# Altium schematic sheet etapa3_energia.SchDoc
size A4
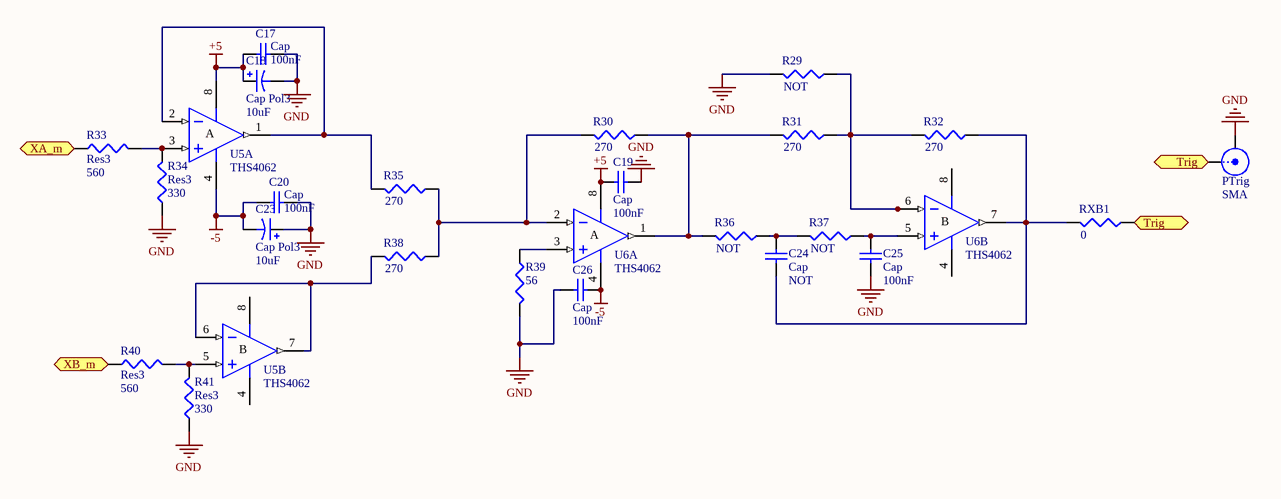
[diagram p0: etapa3_energia.SchDoc]

## Parts
C17  Cap  value 100nF  [6-0805_N]
C18  Cap Pol3  value 10uF  [6-0805_N]
C19  Cap  value 100nF  [1608[0603]]
C20  Cap  value 100nF  [6-0805_N]
C23  Cap Pol3  value 10uF  [6-0805_N]
C24  Cap  value NOT  [1608[0603]]
C25  Cap  value 100nF  [1608[0603]]
C26  Cap  value 100nF  [1608[0603]]
PTrig  SMA  [SMB_V-RJ45]
R29  value NOT  [J1-0603]  (hidden comment: Res3)
R30  value 270  [J1-0603]  (hidden comment: Res3)
R31  value 270  [J1-0603]  (hidden comment: Res3)
R32  value 270  [J1-0603]  (hidden comment: Res3)
R33  Res3  value 560  [J1-0603]
R34  Res3  value 330  [J1-0603]
R35  value 270  [J1-0603]  (hidden comment: Res3)
R36  value NOT  [J1-0603]  (hidden comment: Res3)
R37  value NOT  [J1-0603]  (hidden comment: Res3)
R38  value 270  [J1-0603]  (hidden comment: Res3)
R39  value 56  [J1-0603]  (hidden comment: Res3)
R40  Res3  value 560  [J1-0603]
R41  Res3  value 330  [J1-0603]
RXB1  value 0  [J1-0603]  (hidden comment: Res3)
U5  THS4062  [SO-8_M]  (parts A,B of 2)
U6  THS4062  [SO-8_M]  (parts A,B of 2)

## Ports
Trig (out), XA_m (out), XB_m (out)

## Nets
+5: C17.2 C18.1 C19.1 U5.8(V+) U6.8(V+)
-5: C20.2 C23.2 C26.2 U5.4(V-) U6.4(V-)
GND: C17.1 C18.2 C19.2 C20.1 C23.1 C25.2 C26.1 PTrig.2(Y) R29.2 R34.1 R39.2 R41.1
Trig: PTrig.1(X) RXB1.1 ; port Trig
XA_m: R33.1 ; port XA_m
XB_m: R40.1 ; port XB_m
NetC24_1: C24.1 R36.1 R37.2
NetC24_2: C24.2 R32.1 RXB1.2 U6.7(OUT)
NetC25_1: C25.1 R37.1 U6.5(IN+)
NetR29_1: R29.1 R31.1 R32.2 U6.6(IN-)
NetR30_1: R30.1 R31.2 R36.2 U6.1(OUT)
NetR30_2: R30.2 R35.1 R38.1 U6.2(IN-)
NetR33_2: R33.2 R34.2 U5.3(IN+)
NetR35_2: R35.2 U5.1(OUT) U5.2(IN-)
NetR38_2: R38.2 U5.6(IN-) U5.7(OUT)
NetR39_1: R39.1 U6.3(IN+)
NetR40_2: R40.2 R41.2 U5.5(IN+)

## Notes on the sheet
- (in symbol AD8002AR, part A) A
- (in symbol AD8002AR, part B) B

## Library data of the parts
C17 C19 C20 C24-C26 = Cap: Capacitor; Published: 8-Jun-2000; LatestRevisionDate: 17-Jul-2002; LatestRevisionNote: Re-released for DXP Platform.; PackageReference: RAD-0.3; Publisher: Altium Limited; PackageDescription: Radial Cap, Thru-Hole; 2 Leads; 0.3 in Pin Spacing
C18 C23 = Cap Pol3: Polarized Capacitor (Surface Mount); Published: 8-Jun-2000; LatestRevisionDate: 29-May-2009; LatestRevisionNote: IPC-7351 Footprint Added.; PackageReference: C0805; Publisher: Altium Limited; PackageDescription: Chip Capacitor
PTrig = SMB: SMB Straight Connector; LatestRevisionDate: 17-Jul-2002; LatestRevisionNote: Re-released for DXP Platform.; Publisher: Altium Limited
R29-R41 RXB1 = Res3: Resistor; Published: 8-Jun-2000; LatestRevisionDate: 29-May-2009; LatestRevisionNote: IPC-7351 Footprint Added.; PackageReference: J1-0603; Publisher: Altium Limited; PackageDescription: Chip Resistor
U5 U6 = AD8002AR: Dual 600MHz, 50mW Current Feedback Amplifier; Published: 8-Jun-2000; LatestRevisionDate: 13-Apr-2006; LatestRevisionNote: IPC-7351 Footprint Added.; DatasheetVersion: REV. C 1999; PackageVersion: revA; PackageReference: SO-8; Publisher: Altium Limited; PackageDescription: 8-Pin Small Outline Integrated Circuit 1.27 mm Pitch; Code_JEDEC: MS-012-AA; Code_IPC: SOIC127P600-8; ComponentLink1Description: Manufacturer Link; ComponentLink1URL: http://www.analog.com/en/prod/0,,759_786_AD8002%2C00.html; ComponentLink2Description: Datasheet; ComponentLink2URL: http://www.analog.com/UploadedFiles/Data_Sheets/147523773AD8002_d.pdf